# Altium schematic sheet DUT_HEADER.SchDoc
size A
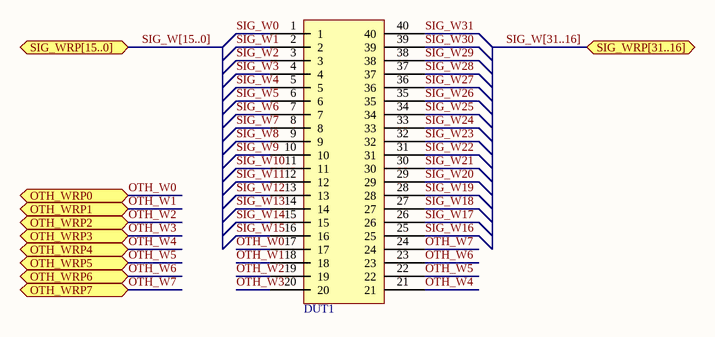
[diagram p0: DUT_HEADER.SchDoc]

## Parts
DUT1  ADAFRUIT_HEADER  [FEMALE_HEADER_SMD]  (value not drawn)

## Ports
OTH_WRP0, OTH_WRP1, OTH_WRP2, OTH_WRP3, OTH_WRP4, OTH_WRP5, OTH_WRP6, OTH_WRP7, SIG_WRP[15..0], SIG_WRP[31..16]

## Nets
OTH_W0: DUT1.17 ; port OTH_WRP0
OTH_W1: DUT1.18 ; port OTH_WRP1
OTH_W2: DUT1.19 ; port OTH_WRP2
OTH_W3: DUT1.20 ; port OTH_WRP3
OTH_W4: DUT1.21 ; port OTH_WRP4
OTH_W5: DUT1.22 ; port OTH_WRP5
OTH_W6: DUT1.23 ; port OTH_WRP6
OTH_W7: DUT1.24 ; port OTH_WRP7
SIG_W0: DUT1.1
SIG_W1: DUT1.2
SIG_W2: DUT1.3
SIG_W3: DUT1.4
SIG_W4: DUT1.5
SIG_W5: DUT1.6
SIG_W6: DUT1.7
SIG_W7: DUT1.8
SIG_W8: DUT1.9
SIG_W9: DUT1.10
SIG_W10: DUT1.11
SIG_W11: DUT1.12
SIG_W12: DUT1.13
SIG_W13: DUT1.14
SIG_W14: DUT1.15
SIG_W15: DUT1.16
SIG_W16: DUT1.25
SIG_W17: DUT1.26
SIG_W18: DUT1.27
SIG_W19: DUT1.28
SIG_W20: DUT1.29
SIG_W21: DUT1.30
SIG_W22: DUT1.31
SIG_W23: DUT1.32
SIG_W24: DUT1.33
SIG_W25: DUT1.34
SIG_W26: DUT1.35
SIG_W27: DUT1.36
SIG_W28: DUT1.37
SIG_W29: DUT1.38
SIG_W30: DUT1.39
SIG_W31: DUT1.40

## Buses and harness runs
bus SIG_W[15..0] = port SIG_WRP[15..0]
bus SIG_W[31..16] = port SIG_WRP[31..16]

## Library data of the parts
DUT1 = ADAFRUIT_HEADER: Extra tall female header (SMD)